# EAGLE design MRCS-Approach-Indicator (EAGLE 7.7.0)
PCR Clinic board
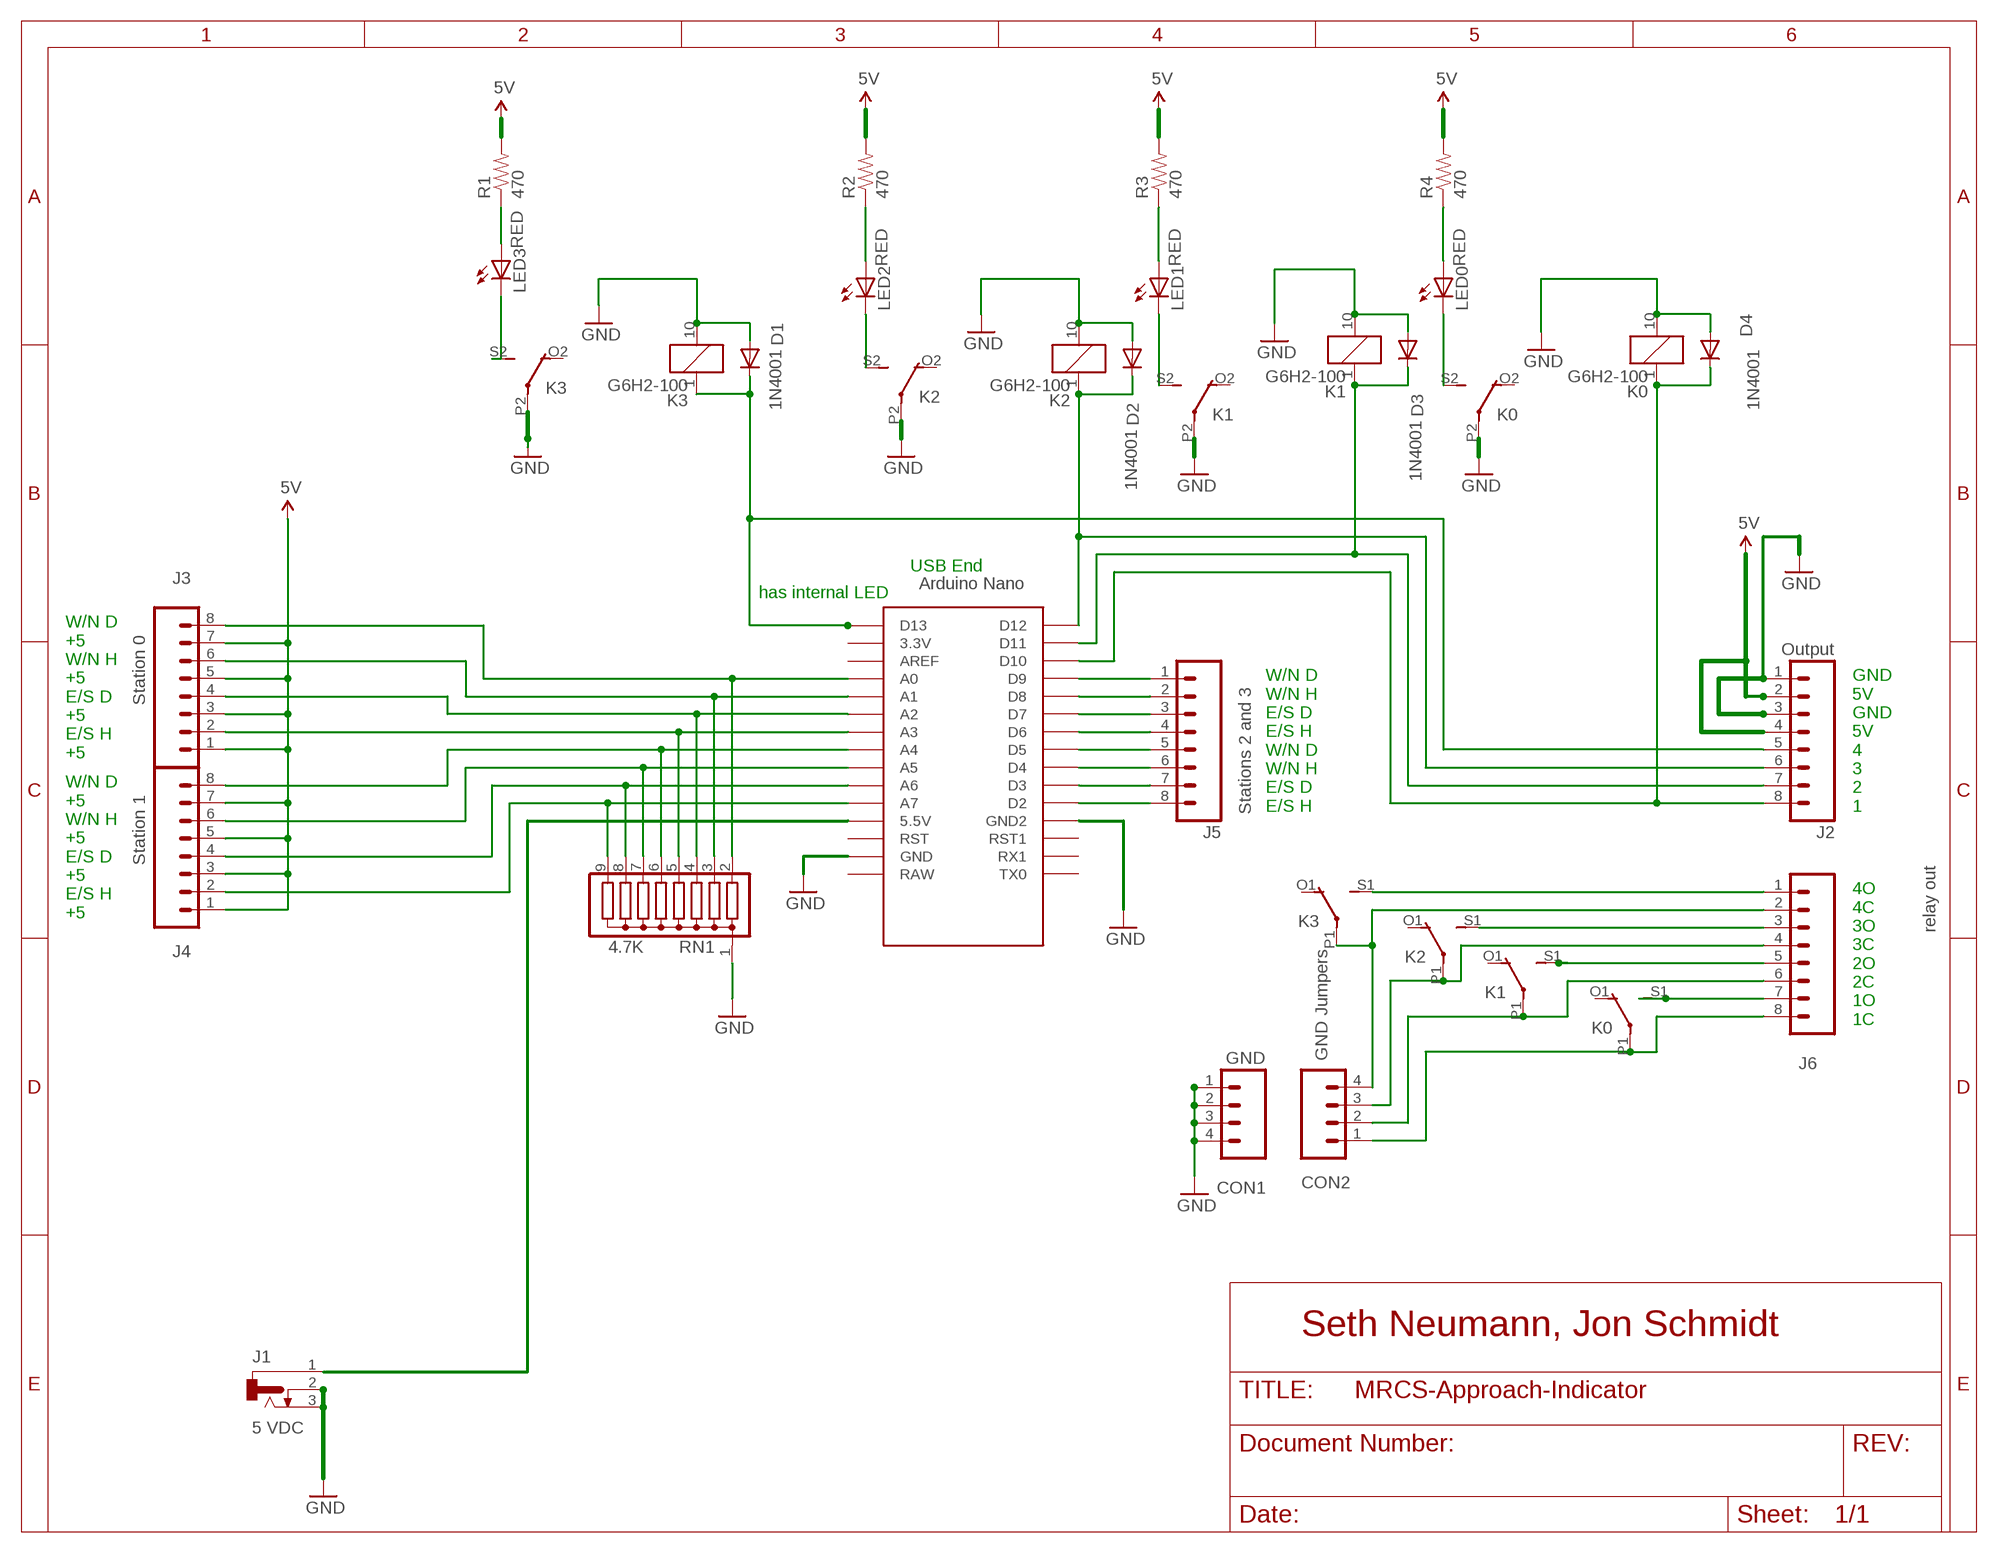
[diagram p0: schematic, sheet 1]

## Parts
CON1  GND  CONNECTOR-M04LOCK  [1X04_LOCK]
CON2  GND Jumpers  CONNECTOR-M04LOCK  [1X04_LOCK]
D1  1N4001  DIODEPTH  [DIODE-1N4001]
D2  1N4001  DIODEPTH  [DIODE-1N4001]
D3  1N4001  DIODEPTH  [DIODE-1N4001]
D4  1N4001  DIODEPTH  [DIODE-1N4001]
J1  5 VDC  CONNECTOR-DC-POWER-RA  [DCJ0202]
J2  Output  CONNECTOR-M08LOCK  [1X08_LOCK]
J3  Station 0  CONNECTOR-M08LOCK  [1X08_LOCK]
J4  Station 1  CONNECTOR-M08LOCK  [1X08_LOCK]
J5  Stations 2 and 3  CONNECTOR-M08LOCK  [1X08_LOCK]
J6  relay out  CONNECTOR-M08LOCK  [1X08_LOCK]
K0  G6H2-100  [G6H2-100]
K1  G6H2-100  [G6H2-100]
K2  G6H2-100  [G6H2-100]
K3  G6H2-100  [G6H2-100]
LED0  RED  LEDLED3MM  [LED3MM]
LED1  RED  LEDLED3MM  [LED3MM]
LED2  RED  LEDLED3MM  [LED3MM]
LED3  RED  LEDLED3MM  [LED3MM]
NANO  NANO  [NANO]
R1  470  RPTH04  [AXIAL-0.4-RES]
R2  470  RPTH04  [AXIAL-0.4-RES]
R3  470  RPTH04  [AXIAL-0.4-RES]
R4  470  RPTH04  [AXIAL-0.4-RES]
RN1  4.7K  G08R  [SIL9]

## Nets
5V [Power]: J1.1 J2.2 J2.4 J3.1 J3.3 J3.5 J3.7 J4.1 J4.3 J4.5 J4.7 NANO.5V(5.5V) R1.P$2 R2.P$2 R3.P$2 R4.P$2
D7: D1.C J2.5 K3.1 NANO.D13
D12: D2.C J2.6 K2.1 NANO.D12
GND [Power]: CON1.1 CON1.2 CON1.3 CON1.4 D1.A D2.A D3.A D4.A J1.2 J1.3 J2.1 J2.3 K0.10 K0.P2(3:P) K1.10 K1.P2(3:P) K2.10 K2.P2(3:P) K3.10 K3.P2(3:P) NANO.GND NANO.GND1(GND2) RN1.1
N$1: J6.3 K2.S1(2:S)
N$2: D4.C J2.8 K0.1 NANO.D10
N$3: J3.8 NANO.A0 RN1.2
N$4: J3.6 NANO.A1 RN1.3
N$5: J3.4 NANO.A2 RN1.4
N$6: J3.2 NANO.A3 RN1.5
N$7: J6.1 K3.S1(2:S)
N$8: CON2.3 J6.4 K2.P1(2:P)
N$9: J4.8 NANO.A4 RN1.6
N$10: J4.6 NANO.A5 RN1.7
N$11: J4.4 NANO.A6 RN1.8
N$12: J4.2 NANO.A7 RN1.9
N$13: J5.8 NANO.D2
N$14: J5.7 NANO.D3
N$15: J5.6 NANO.D4
N$16: J5.5 NANO.D5
N$17: J5.4 NANO.D6
N$18: J5.3 NANO.D7
N$19: J5.2 NANO.D8
N$20: J5.1 NANO.D9
N$21: J6.5 K1.S1(2:S)
N$22: CON2.4 J6.2 K3.P1(2:P)
N$23: CON2.2 J6.6 K1.P1(2:P)
N$24: J6.7 K0.S1(2:S)
N$25: CON2.1 J6.8 K0.P1(2:P)
N$26: K3.S2(3:S) LED3.K(C)
N$27: LED3.A R1.P$1
N$28: LED2.A R2.P$1
N$29: K2.S2(3:S) LED2.K(C)
N$30: LED1.A R3.P$1
N$31: K1.S2(3:S) LED1.K(C)
N$32: LED0.A R4.P$1
N$33: K0.S2(3:S) LED0.K(C)
N$34: D3.C J2.7 K1.1 NANO.D11
Unconnected: K0.O1(2:O) K0.O2(3:O) K1.O1(2:O) K1.O2(3:O) K2.O1(2:O) K2.O2(3:O) K3.O1(2:O) K3.O2(3:O) NANO.3.3V NANO.AREF NANO.RAW NANO.RST NANO.RST1 NANO.RX1 NANO.TX0

## Notes on the sheet
- USB End
- has internal LED
- W/N D
  +5
  W/N H
  +5
  E/S D
  +5
  E/S H
  +5
- W/N D
  W/N H
  E/S D
  E/S H
  W/N D
  W/N H
  E/S D
  E/S H
- GND
  5V
  GND
  5V
  4
  3
  2
  1
- W/N D
  +5
  W/N H
  +5
  E/S D
  +5
  E/S H
  +5
- 4O
  4C
  3O
  3C
  2O
  2C
  1O
  1C
- Seth Neumann, Jon Schmidt

## Library data of the parts
CON1 CON2 = SPCoast:CONNECTOR-M04: Header 4 Standard 4-pin 0.1" header. Use with straight break away headers (SKU : PRT-00116), right angle break away headers (PRT-00553), swiss pins (PRT-00743), machine pins (PRT-00117), and female headers (PRT-00115). Molex polarized connector foot print use with SKU : PRT-08231 with associated crimp pins and housings. 1MM SMD Version SKU: PRT-10208
D1-D4 = SPCoast:DIODE: Diode These are standard reverse protection diodes and small signal diodes. SMA package can handle up to about 1A. SOD-323 can handle about 200mA. What the SOD-323 package when ordering, there are some mfgs out there that are 5-pin packages.
J1 = SPCoast:CONNECTOR-DC-POWER: DC POWER JACK
J2-J6 = SPCoast:CONNECTOR-M08: Header 8 Standard 8-pin 0.1" header. Use with straight break away headers (SKU : PRT-00116), right angle break away headers (PRT-00553), swiss pins (PRT-00743), machine pins (PRT-00117), and female headers (PRT-00115).
K0 K1-K3 = relay:G6H2-100: RELAY 2 x switch, 0.5 A/125 V AC, 1 A/30 V DC, Omron; OC_FARNELL: unknown; OC_NEWARK: unknown
LED0 LED1-LED3 = SPCoast:LED*
NANO = Arduino-clone-scn:NANO: Arduino Nano
R1-R4 = SPCoast:R*: Resistor Basic schematic elements and footprints for 0603, 1206, and PTH 1/10th watt (small) resistors.
RN1 = resistor-sil:G08R: SIL RESISTOR; OC_FARNELL: unknown; OC_NEWARK: unknown

## Net classes
0 default: width 0.305 mm
1 Power: width 0.61 mm

## Board
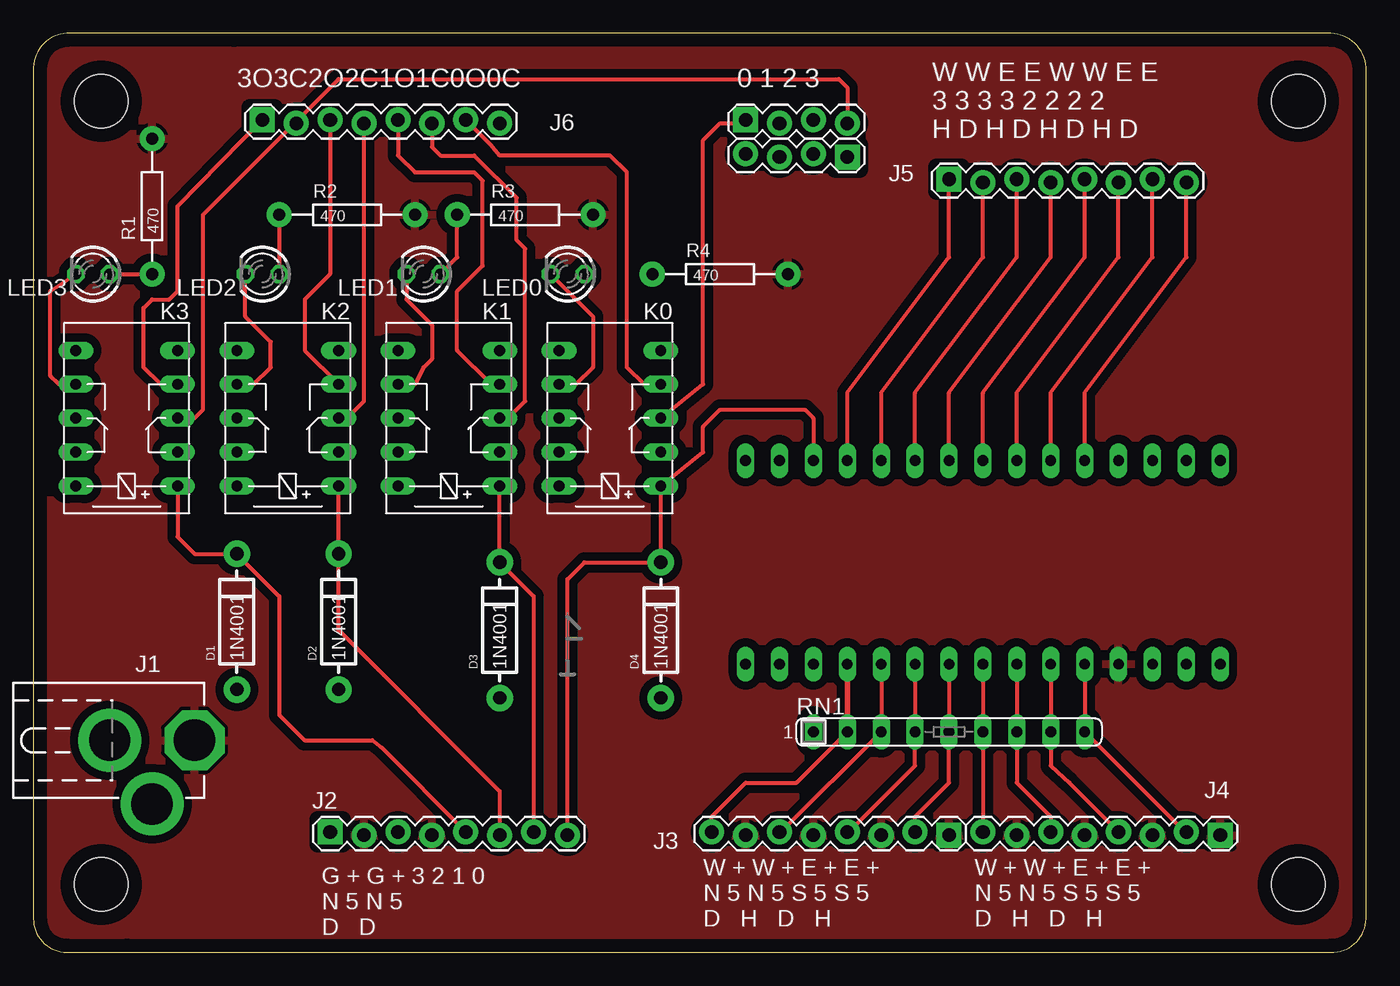
[diagram p1: board, top side]
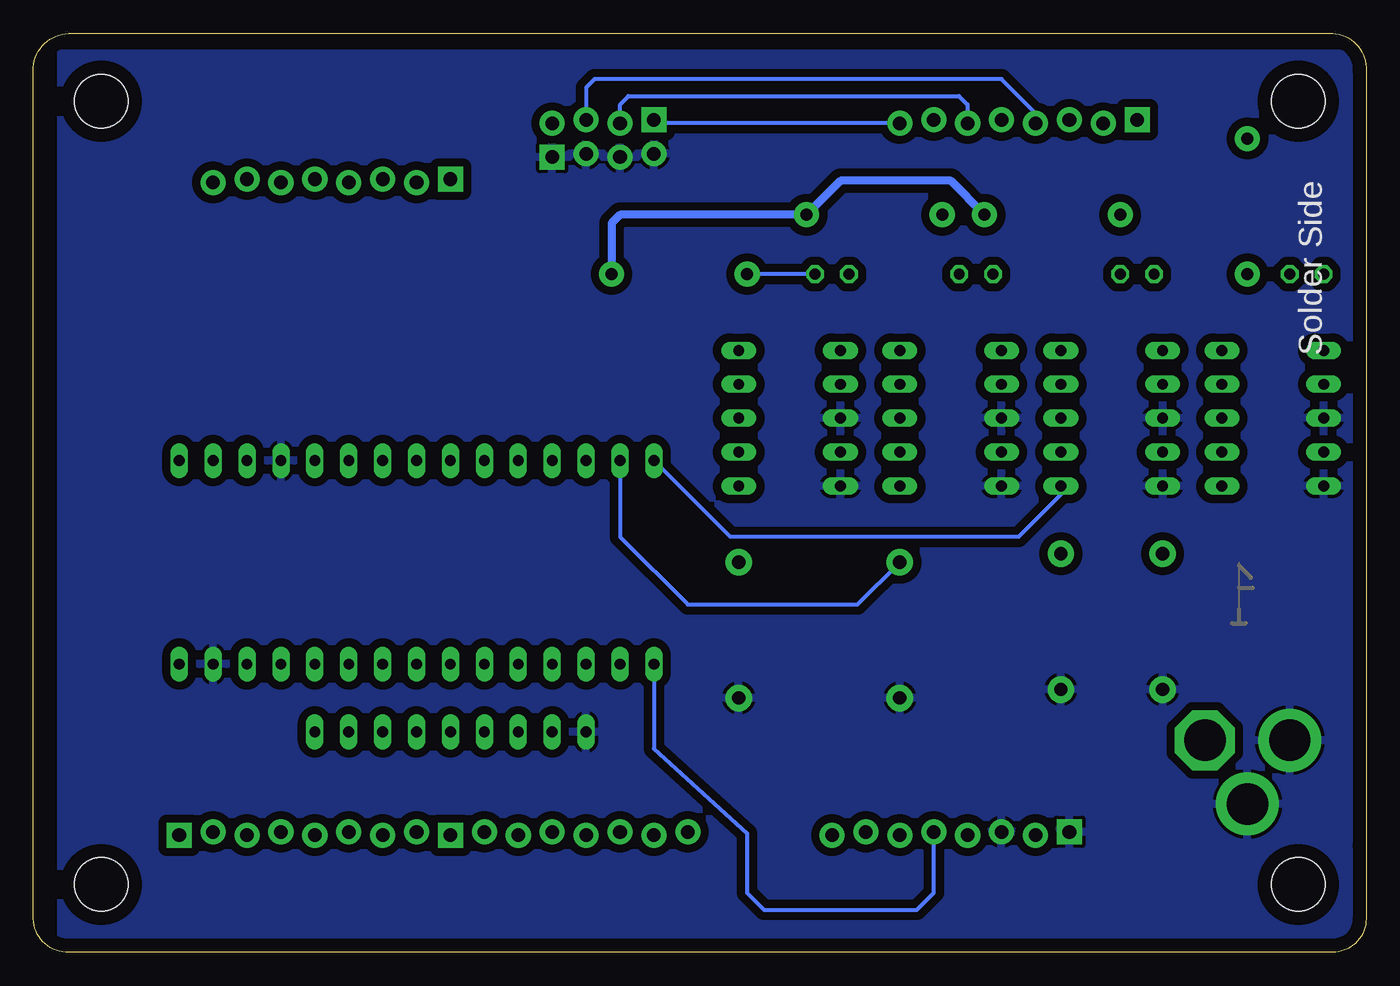
[diagram p2: board, bottom side, seen from below]

Size 99.82 x 68.83 mm. Coordinates in mm from the lower left corner, seen from the top.
Copper layers (1*16): Top 0.035mm / dielectric 1.5mm / Bottom 0.035mm
Design rules "default": minimum track width 10mil, minimum drill 24mil, track to track 8mil, track to pad 8mil, pad to pad 8mil, via to via 8mil, smd to smd 8mil, copper to edge 40mil, drill to drill 8mil, minimum pad ring 10mil, minimum via ring 8mil, stop-mask expansion 4mil, vias tented up to drill 0mil, thermal gap 10mil

### Footprints (pad centres in the part's own frame; a part is rotated, then mirrored left to right if it is on the bottom)
1X04_LOCK = drill 1.016 pad 1.88 square: 1 0,0.127 | drill 1.016 pad 1.88: 2 2.54,-0.127; 3 5.08,0.127; 4 7.62,-0.127
DIODE-1N4001 = drill 1 pad 1.981: A 5.08,0; C -5.08,0
DCJ0202 = drill 3.1 pad 4.5 octagon: 1 0,3.175 | drill 3.1 pad 4.7: 2 4.763,0; 3 0,-3.175
1X08_LOCK = drill 1.016 pad 1.88 square: 1 0,0.127 | drill 1.016 pad 1.88: 2 2.54,-0.127; 3 5.08,0.127; 4 7.62,-0.127; 5 10.16,0.127; 6 12.7,-0.127; 7 15.24,0.127; 8 17.78,-0.127
G6H2-100 = drill 0.813 long: 1 -5.08,-3.81; 5 5.08,-3.81; 6 5.08,3.81; 10 -5.08,3.81; O1 -2.54,-3.81; O2 -2.54,3.81; P1 0,-3.81; P2 0,3.81; S1 2.54,-3.81; S2 2.54,3.81
LED3MM = drill 0.813 octagon: A 1.27,0; K -1.27,0
NANO = drill 0.8 long: 3.3V -10.16,24.13; 5V -10.16,-1.27; A0 -10.16,19.05; A1 -10.16,16.51; A2 -10.16,13.97; A3 -10.16,11.43; A4 -10.16,8.89; A5 -10.16,6.35; A6 -10.16,3.81; A7 -10.16,1.27; AREF -10.16,21.59; D2 5.08,1.27; D3 5.08,3.81; D4 5.08,6.35; D5 5.08,8.89; D6 5.08,11.43; D7 5.08,13.97; D8 5.08,16.51; D9 5.08,19.05; D10 5.08,21.59; D11 5.08,24.13; D12 5.08,26.67; D13 -10.16,26.67; GND -10.16,-6.35; GND1 5.08,-1.27; RAW -10.16,-8.89; RST -10.16,-3.81; RST1 5.08,-3.81; RX1 5.08,-6.35; TX0 5.08,-8.89
AXIAL-0.4-RES = drill 0.9 pad 1.88: P$1 -5.08,0; P$2 5.08,0
SIL9 = drill 0.813 long: 1 -10.16,0; 2 -7.62,0; 3 -5.08,0; 4 -2.54,0; 5 0,0; 6 2.54,0; 7 5.08,0; 8 7.62,0; 9 10.16,0
BOARD-DINRAIL-2.7IN = hole 4: 94.742,5.08; 5.08,63.754; 94.742,63.754; 5.08,5.08

### Placement (x,y rotation side)
CON1  60.96,59.69 180 top
CON2  53.34,62.23 0 top
D1  15.24,24.77 270 top
D2  22.86,24.77 270 top
D3  34.93,24.13 270 top
D4  46.99,24.13 270 top
J1  8.89,15.88 270 top
J2  22.23,8.89 0 top
J3  68.58,8.89 180 top
J4  88.9,8.89 180 top
J5  68.58,57.78 0 top
J6  17.15,62.23 0 top
K0  43.18,40 90 top
K1  31.12,40 90 top
K2  19.05,40 90 top
K3  6.99,40 90 top
LED0  40.01,50.8 0 top
LED1  29.21,50.8 0 top
LED2  17.15,50.8 0 top
LED3  4.45,50.8 0 top
NANO  80.01,31.75 90 top
R1  8.89,55.88 90 top
R2  23.5,55.24 0 top
R3  36.83,55.24 0 top
R4  51.44,50.8 0 top
RN1  68.58,16.51 0 top
U$1  [BOARD-DINRAIL-2.7IN]  0,0 0 top
U$2  [MRCSLOGOTOP]  38.74,20.32 0 top
U$3  [MRCSLOGOBTM]  3.18,24.13 0 top
U$5  [CA-PROP65WARNING]  75.57,26.67 0 top

### Tracks (layer width: path | path; a pad name or v marks a point on that pad's centre or on a via)
5V
  Bottom 0.61: R2.P$2 31.12,57.78 39.37,57.78 R3.P$2 55.88,55.24 56.52,54.61 R4.P$2
  pour Top (isolate 0.61): 0,68.58 99.06,68.58 100.33,0 0,0
D7
  Top 0.305: K3.1 10.8,31.11 12.07,29.84 D1.C 18.42,26.67 18.42,17.78 20.32,15.88 25.4,15.88 26.04,15.37 J2.5
  Bottom 0.305: NANO.D13 53.34,15.24 46.36,8.89 46.36,4.45 45.09,3.18 33.66,3.18 32.39,4.45 J2.5
D12
  Top 0.305: J2.6 34.93,12.07 22.86,24.13 D2.C K2.1
  Bottom 0.305: K2.1 22.86,34.29 26.04,31.11 47.63,31.11 NANO.D12
GND
  pour Bottom (isolate 0.61): -2.54,67.31 97.79,67.31 97.79,-1.27 -2.54,0
N$1
  Top 0.305: J6.3 22.23,50.8 20.32,48.89 20.32,45.08 K2.S1
N$2
  Top 0.305: NANO.D10 58.42,40 57.79,40.64 51.44,40.64 50.17,39.37 50.17,37.46 K0.1 D4.C 41.28,29.21 40.01,27.94 J2.8
N$3
  Top 0.305: J3.8 50.8,10.16 53.34,12.7 57.15,12.7 RN1.2
  Top 0.406: NANO.A0 RN1.2
N$4
  Top 0.305: NANO.A1 RN1.3 56.01,9.02 J3.6
N$5
  Top 0.305: NANO.A2 RN1.4 66.04,13.97 61.09,9.02 J3.4
N$6
  Top 0.305: NANO.A3 RN1.5 68.58,12.7 66.04,10.16 J3.2
N$7
  Top 0.305: J6.1 10.8,55.88 10.8,49.53 10.16,48.89 8.89,48.89 8.26,48.26 8.26,43.81 9.53,42.54 K3.S1
N$8
  Top 0.305: K2.P1 23.5,40 24.77,41.27 J6.4
  Bottom 0.305: J6.4 24.77,62.87 27.31,65.41 57.79,65.41 58.42,64.77 CON2.3
N$9
  Top 0.305: NANO.A4 RN1.6 J4.8
N$10
  Top 0.305: 76.2,8.89 J4.6 76.2,10.16 73.66,12.7 RN1.7 NANO.A5
N$11
  Top 0.305: NANO.A6 RN1.8 76.2,13.97 77.6,12.7 J4.4
N$12
  Top 0.305: NANO.A7 RN1.9 86.24,9.02 J4.2
N$13
  Top 0.305: NANO.D2 78.74,41.91 86.36,52.07 J5.8
N$14
  Top 0.305: NANO.D3 76.2,41.91 83.82,52.07 J5.7
N$15
  Top 0.305: NANO.D4 73.66,41.91 81.28,52.07 J5.6
N$16
  Top 0.305: NANO.D5 71.12,41.91 78.74,52.07 J5.5
N$17
  Top 0.305: NANO.D6 68.58,41.91 76.2,52.07 J5.4
N$18
  Top 0.305: NANO.D7 66.04,41.91 73.66,52.07 J5.3
N$19
  Top 0.305: NANO.D8 63.5,41.91 71.12,52.07 J5.2
N$20
  Top 0.305: NANO.D9 60.96,41.91 68.58,52.07 J5.1
N$21
  Top 0.305: K1.S1 34.29,42.54 31.75,45.08 31.75,49.53 33.66,51.43 33.66,57.78 33.02,58.42 28.58,58.42 27.31,59.69 J6.5
N$22
  Top 0.305: K3.P1 12.07,40 12.7,40.64 12.7,55.24 18.93,61.47 J6.2 19.69,62.23 22.86,65.41 60.33,65.41 60.96,64.77 CON2.4
N$23
  Top 0.305: K1.P1 35.56,40 36.83,41.27 36.83,52.7 36.2,53.34 36.2,56.51 33.02,59.69 30.48,59.69 29.85,60.32 J6.6
  Bottom 0.305: CON2.2 55.88,63.5 55.25,64.14 30.48,64.14 29.85,63.5 J6.6
N$24
  Top 0.305: K0.S1 45.72,42.54 44.45,43.81 44.45,58.42 43.18,59.69 34.93,59.69 34.29,60.45 J6.7
N$25
  Top 0.305: K0.P1 50.17,42.54 50.17,60.83 51.44,62.1 53.09,62.1 CON2.1
  Bottom 0.305: J6.8 53.09,62.1 CON2.1
N$26
  Top 0.305: K3.S2 1.91,42.54 1.27,43.18 1.27,49.53 LED3.K
N$27
  Top 0.305: LED3.A R1.P$1
N$28
  Top 0.305: R2.P$1 LED2.A
N$29
  Top 0.305: LED2.K 15.88,47.62 17.78,45.72 17.78,43.81 16.51,42.54 K2.S2
N$30
  Top 0.305: LED1.A 31.75,52.07 R3.P$1
N$31
  Top 0.305: 26.67,42.54 K1.S2 28.58,42.54 29.21,43.81 29.85,44.45 29.85,46.99 27.94,48.89 LED1.K
N$32
  Bottom 0.305: LED0.A R4.P$1
N$33
  Top 0.305: 38.74,42.54 K0.S2 40.64,42.54 41.91,43.81 41.91,47.62 LED0.K
N$34
  Top 0.305: 37.47,8.26 J2.7 37.47,26.67 D3.C K1.1
  Bottom 0.305: NANO.D11 55.88,31.11 50.8,26.04 38.1,26.04 D3.C

### Text on the board
tPlace: 3O3C2O2C1O1C0O0C | 0 1 2 3 | W W E E W W E E / 3 3 3 3 2 2 2 2 / H D H D H D H D | G + G + 3 2 1 0 / N 5 N 5 / D D | W + W + E + E + / N 5 N 5 S 5 S 5 / D H D H | W + W + E + E + / N 5 N 5 S 5 S 5 / D H D H
bPlace: Solder Side
tDocu: MRCS Approach Indicator | Seth Neumann / Jon Schmidt | V1.1 20211202 | USB | Arduino Nano